# Altium schematic sheet Sheet1.SchDoc
size A4
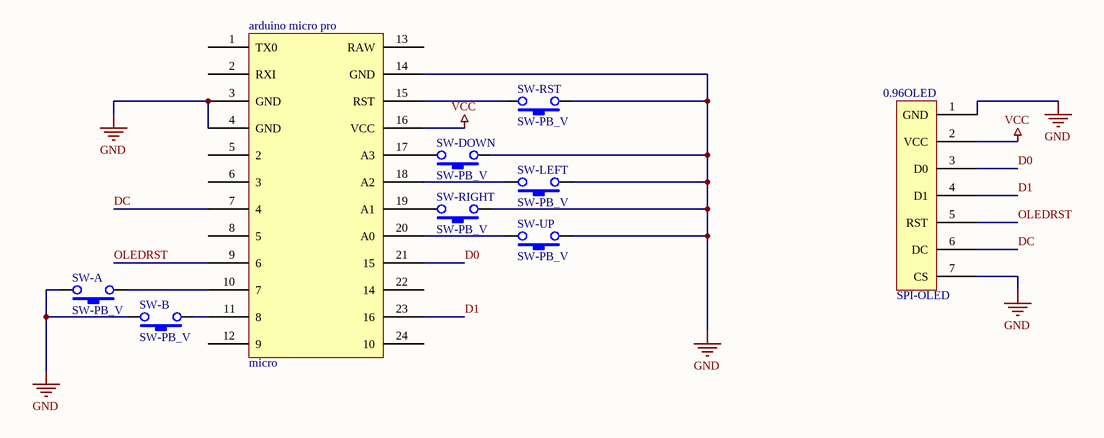
[diagram p0: Sheet1.SchDoc]

## Parts
0.96OLED  SPI-OLED  [SPI-OLED]
arduino_micro_pro  micro  [micro]
SW-A  SW-PB_V  [swich_buttom]
SW-B  SW-PB_V  [swich_buttom]
SW-DOWN  SW-PB_V  [swich_buttom]
SW-LEFT  SW-PB_V  [swich_buttom]
SW-RIGHT  SW-PB_V  [swich_buttom]
SW-RST  SW-PB_V  [swich_buttom]
SW-UP  SW-PB_V  [swich_buttom]

## Nets
GND: 0.96OLED.1(GND) 0.96OLED.7(CS) arduino_micro_pro.3(GND) arduino_micro_pro.4(GND) arduino_micro_pro.14(GND) SW-A.2 SW-B.2 SW-DOWN.1 SW-LEFT.1 SW-RIGHT.1 SW-RST.1 SW-UP.1
VCC: 0.96OLED.2(VCC) arduino_micro_pro.16(VCC)
D0: 0.96OLED.3(D0) arduino_micro_pro.21(15)
D1: 0.96OLED.4(D1) arduino_micro_pro.23(16)
DC: 0.96OLED.6(DC) arduino_micro_pro.7(4)
OLEDRST: 0.96OLED.5(RST) arduino_micro_pro.9(6)
Netarduino_micro_pro_10: arduino_micro_pro.10(7) SW-A.1
Netarduino_micro_pro_11: arduino_micro_pro.11(8) SW-B.1
Netarduino_micro_pro_15: arduino_micro_pro.15(RST) SW-RST.2
Netarduino_micro_pro_17: arduino_micro_pro.17(A3) SW-DOWN.2
Netarduino_micro_pro_18: arduino_micro_pro.18(A2) SW-LEFT.2
Netarduino_micro_pro_19: arduino_micro_pro.19(A1) SW-RIGHT.2
Netarduino_micro_pro_20: arduino_micro_pro.20(A0) SW-UP.2

Not connected (* = marked no-connect by the designer): arduino_micro_pro 1(TX0) 2(RXI) 5(2) 6(3) 8(5) 12(9) 13(RAW) 22(14) 24(10)

## Library data of the parts
SW-A SW-B SW-DOWN SW-LEFT SW-RIGHT SW-RST SW-UP = SW-PB_V: SWITCH